# Altium project diver.PrjPCB
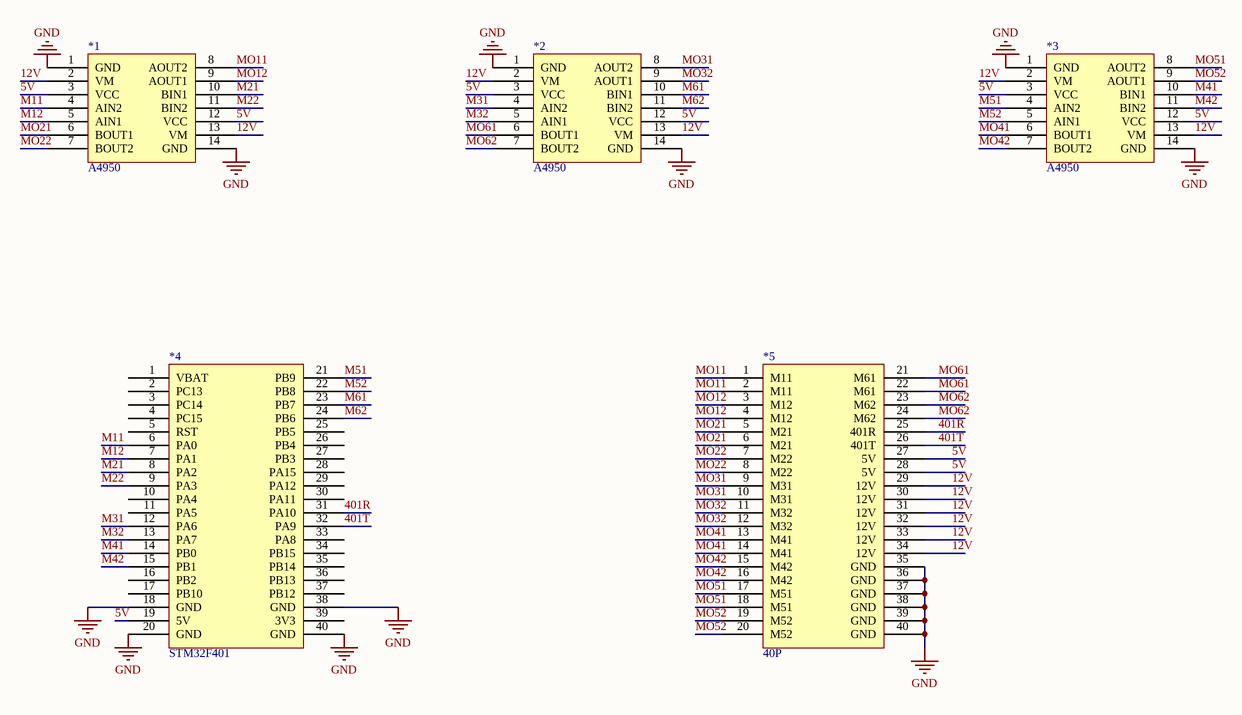
[diagram p0: 驱动板原理图.SchDoc]
1 sheet, 5 parts. Net scope: global (net labels, ports and power ports of the same name join across sheets).
Board file: 驱动板PCB.PcbDoc

## Sheet 驱动板原理图.SchDoc
size A4

### Parts
*1  A4950  [A4950]
*2  A4950  [A4950]
*3  A4950  [A4950]
*4  STM32F401  [STM32F401CCU6]
*5  40P  [PCBComponent_1]

### Nets
GND: *1.1(GND) *1.14(GND) *2.1(GND) *2.14(GND) *3.1(GND) *3.14(GND) *4.18(GND) *4.20(GND) *4.38(GND) *4.40(GND) *5.35(GND) *5.36(GND) *5.37(GND) *5.38(GND) *5.39(GND) *5.40(GND)
5V: *1.3(VCC) *1.12(VCC) *2.3(VCC) *2.12(VCC) *3.3(VCC) *3.12(VCC) *4.19(5V) *5.27(5V) *5.28(5V)
12V: *1.2(VM) *1.13(VM) *2.2(VM) *2.13(VM) *3.2(VM) *3.13(VM) *5.29(12V) *5.30(12V) *5.31(12V) *5.32(12V) *5.33(12V) *5.34(12V)
401R: *4.31(PA10) *5.25(401R)
401T: *4.32(PA9) *5.26(401T)
M11: *1.4(AIN2) *4.6(PA0)
M12: *1.5(AIN1) *4.7(PA1)
M21: *1.10(BIN1) *4.8(PA2)
M22: *1.11(BIN2) *4.9(PA3)
M31: *2.4(AIN2) *4.12(PA6)
M32: *2.5(AIN1) *4.13(PA7)
M41: *3.10(BIN1) *4.14(PB0)
M42: *3.11(BIN2) *4.15(PB1)
M51: *3.4(AIN2) *4.21(PB9)
M52: *3.5(AIN1) *4.22(PB8)
M61: *2.10(BIN1) *4.23(PB7)
M62: *2.11(BIN2) *4.24(PB6)
MO11: *1.8(AOUT2) *5.1(M11) *5.2(M11)
MO12: *1.9(AOUT1) *5.3(M12) *5.4(M12)
MO21: *1.6(BOUT1) *5.5(M21) *5.6(M21)
MO22: *1.7(BOUT2) *5.7(M22) *5.8(M22)
MO31: *2.8(AOUT2) *5.9(M31) *5.10(M31)
MO32: *2.9(AOUT1) *5.11(M32) *5.12(M32)
MO41: *3.6(BOUT1) *5.13(M41) *5.14(M41)
MO42: *3.7(BOUT2) *5.15(M42) *5.16(M42)
MO51: *3.8(AOUT2) *5.17(M51) *5.18(M51)
MO52: *3.9(AOUT1) *5.19(M52) *5.20(M52)
MO61: *2.6(BOUT1) *5.21(M61) *5.22(M61)
MO62: *2.7(BOUT2) *5.23(M62) *5.24(M62)

Not connected (* = marked no-connect by the designer): *4 1(VBAT) 2(PC13) 3(PC14) 4(PC15) 5(RST) 10(PA4) 11(PA5) 16(PB2) 17(PB10) 25(PB5) 26(PB4) 27(PB3) 28(PA15) 29(PA12) 30(PA11) 33(PA8) 34(PB15) 35(PB14) 36(PB13) 37(PB12) 39(3V3)